# EAGLE design fg (EAGLE 7.4.0)
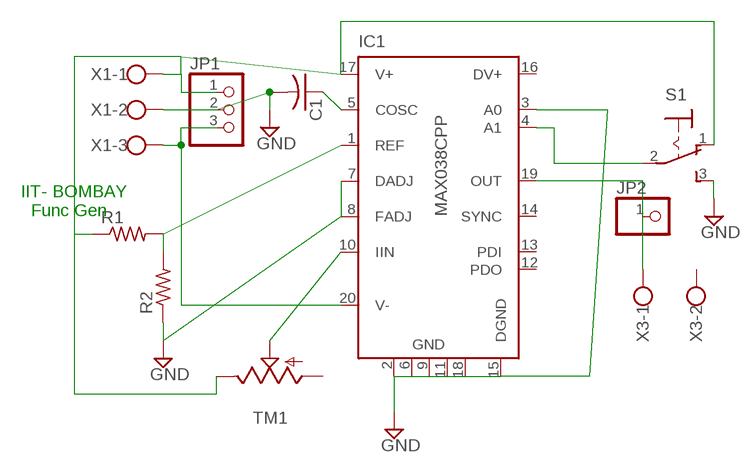
[diagram p0: schematic, sheet 1]

## Parts
C1  C-US050-045X075  [C050-045X075]
IC1  MAX038CPP  [DIL20]
JP1  PINHD-1X3CB  [1X03-CLEANBIG]
JP2  PINHD-1X1CB  [1X01-CLEANBIG]
R1  R-US_0309/10  [0309/10]
R2  R-US_0309/10  [0309/10]
S1  320-916  [320-916]
TM1  TRIM  [6MM]
X1  W237-103  [W237-103]
X3  W237-102  [W237-102]

## Nets
GND: C1.2 IC1.2(GND) IC1.3(A0) IC1.6(GND) IC1.7(DADJ) IC1.8(FADJ) IC1.9(GND) IC1.11(GND) IC1.15(DGND) IC1.18(GND) JP1.2 R2.1 S1.3(S) X1.2
N$1: IC1.17(V+) JP1.1 R1.1 S1.1(O) TM1.E X1.1
N$2: IC1.20(V-) JP1.3 X1.3
N$3: C1.1 IC1.5(COSC)
N$4: IC1.1(REF) R1.2 R2.2
N$6: IC1.10(IIN) TM1.S
N$7: IC1.19(OUT) JP2.1 X3.1
N$8: IC1.4(A1) S1.2(P)
Unconnected: IC1.12(PDO) IC1.13(PDI) IC1.14(SYNC) TM1.A X3.2

## Notes on the sheet
- IIT- BOMBAY
    Func Gen

## Power pins joined to a net without a drawn wire
DV+: IC1.16(DV+)

## Library data of the parts
C1 = adafruit:C-US: CAPACITOR, American symbol
IC1 = maxim:MAX038*: HIGH FREQUENCY WAVEFORM GENERATOR; OC_FARNELL: unknown; OC_NEWARK: unknown
JP1 = adafruit:PINHD-1X3: PIN HEADER
JP2 = adafruit:PINHD-1X1: Pin header 1x1 for 0.1" spacing With round pins
R1 R2 = adafruit:R-US_: RESISTOR, American symbol
S1 = switch:320-916: TOGGLE SWITCH distributor RS Components
TM1 = adafruit:TRIM
X1 = con-wago-500:W237-103: WAGO SCREW CLAMP; MPN: 237-103; OC_FARNELL: unknown; OC_NEWARK: 18M7116
X3 = con-wago-500:W237-102: WAGO SCREW CLAMP; MPN: 237-102; OC_FARNELL: unknown; OC_NEWARK: 70K9898

## Board
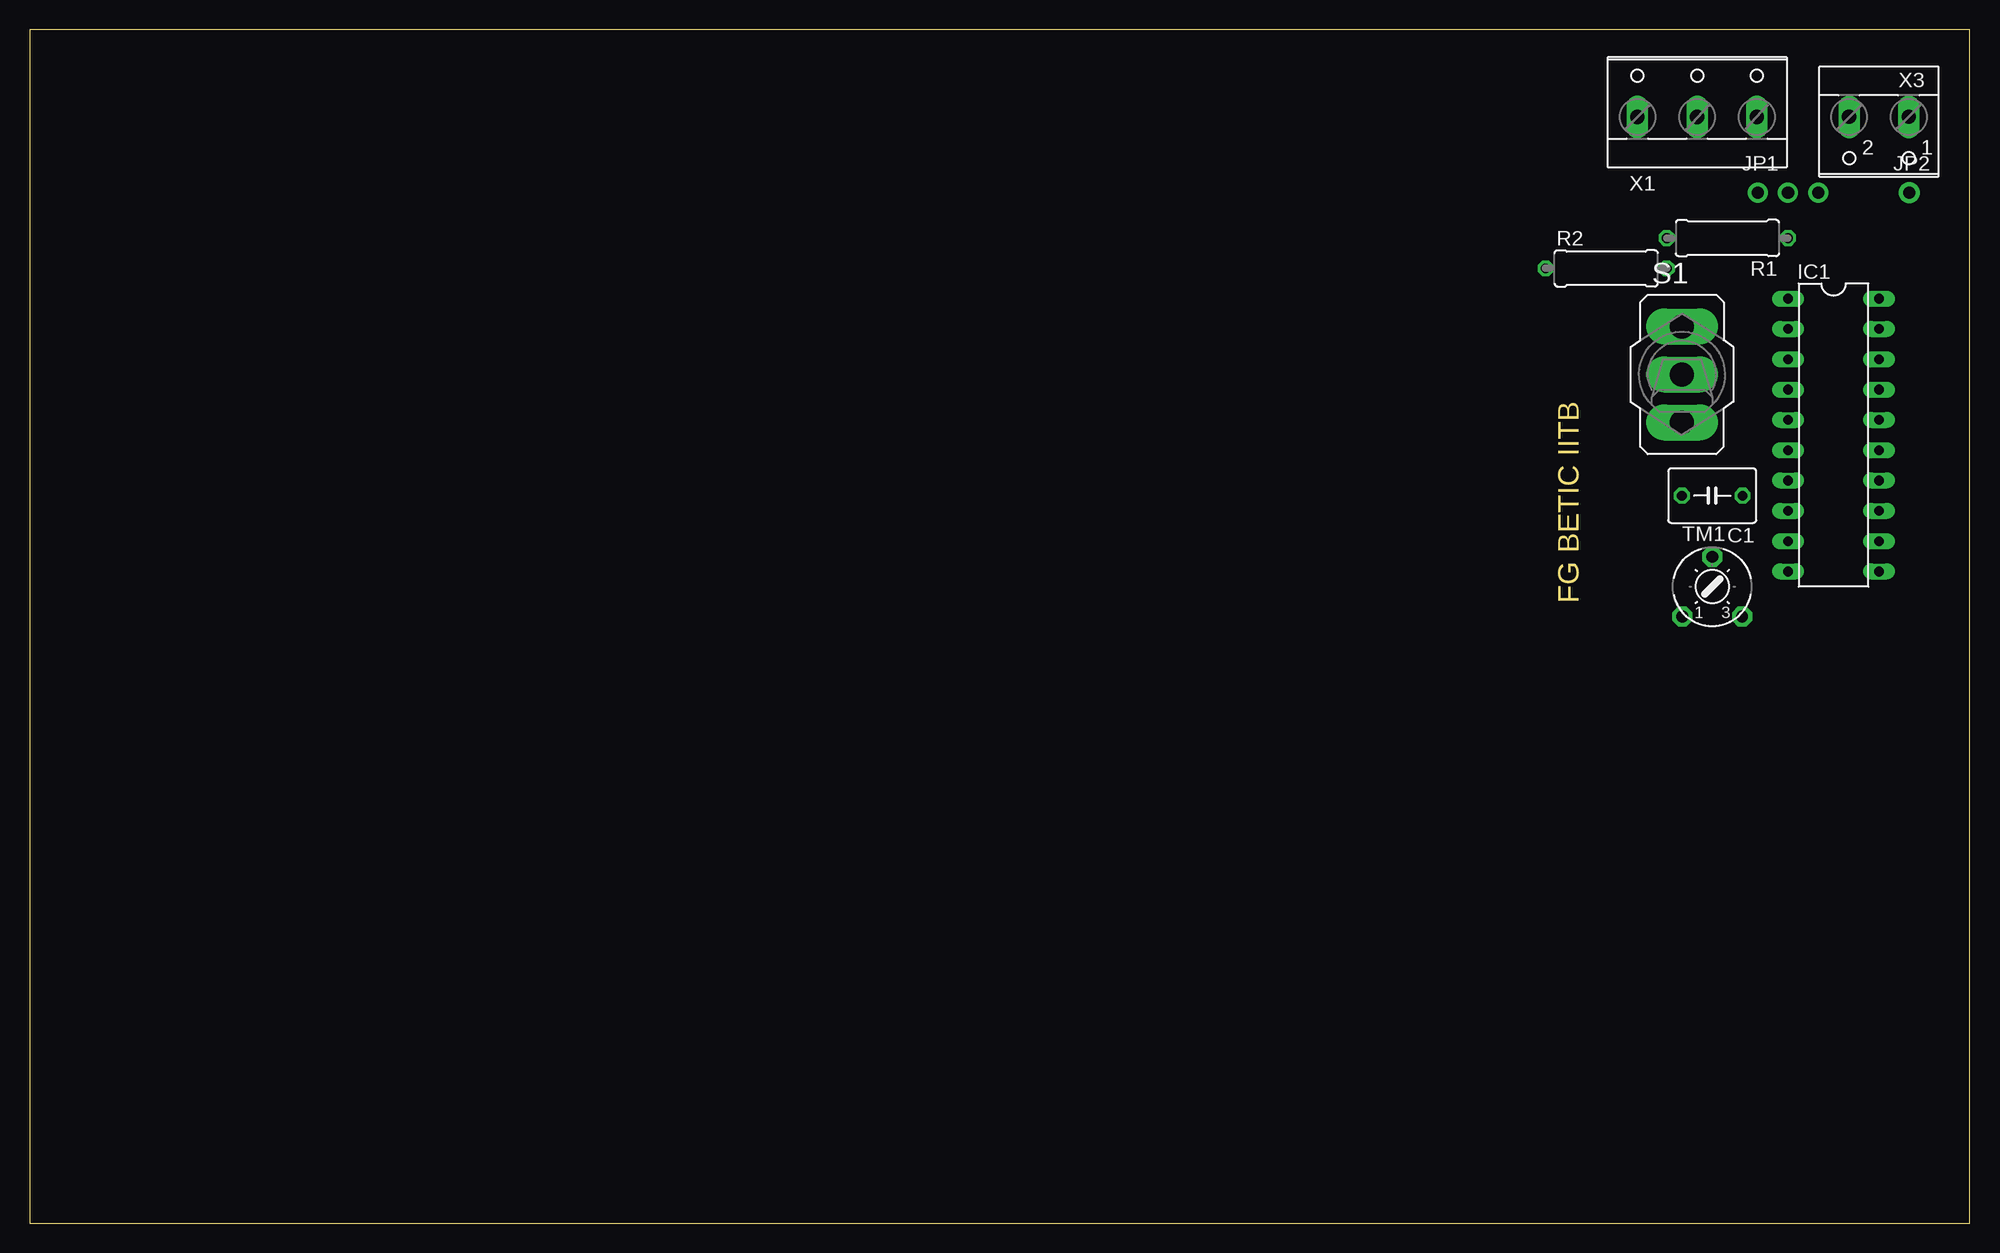
[diagram p1: board, top side]
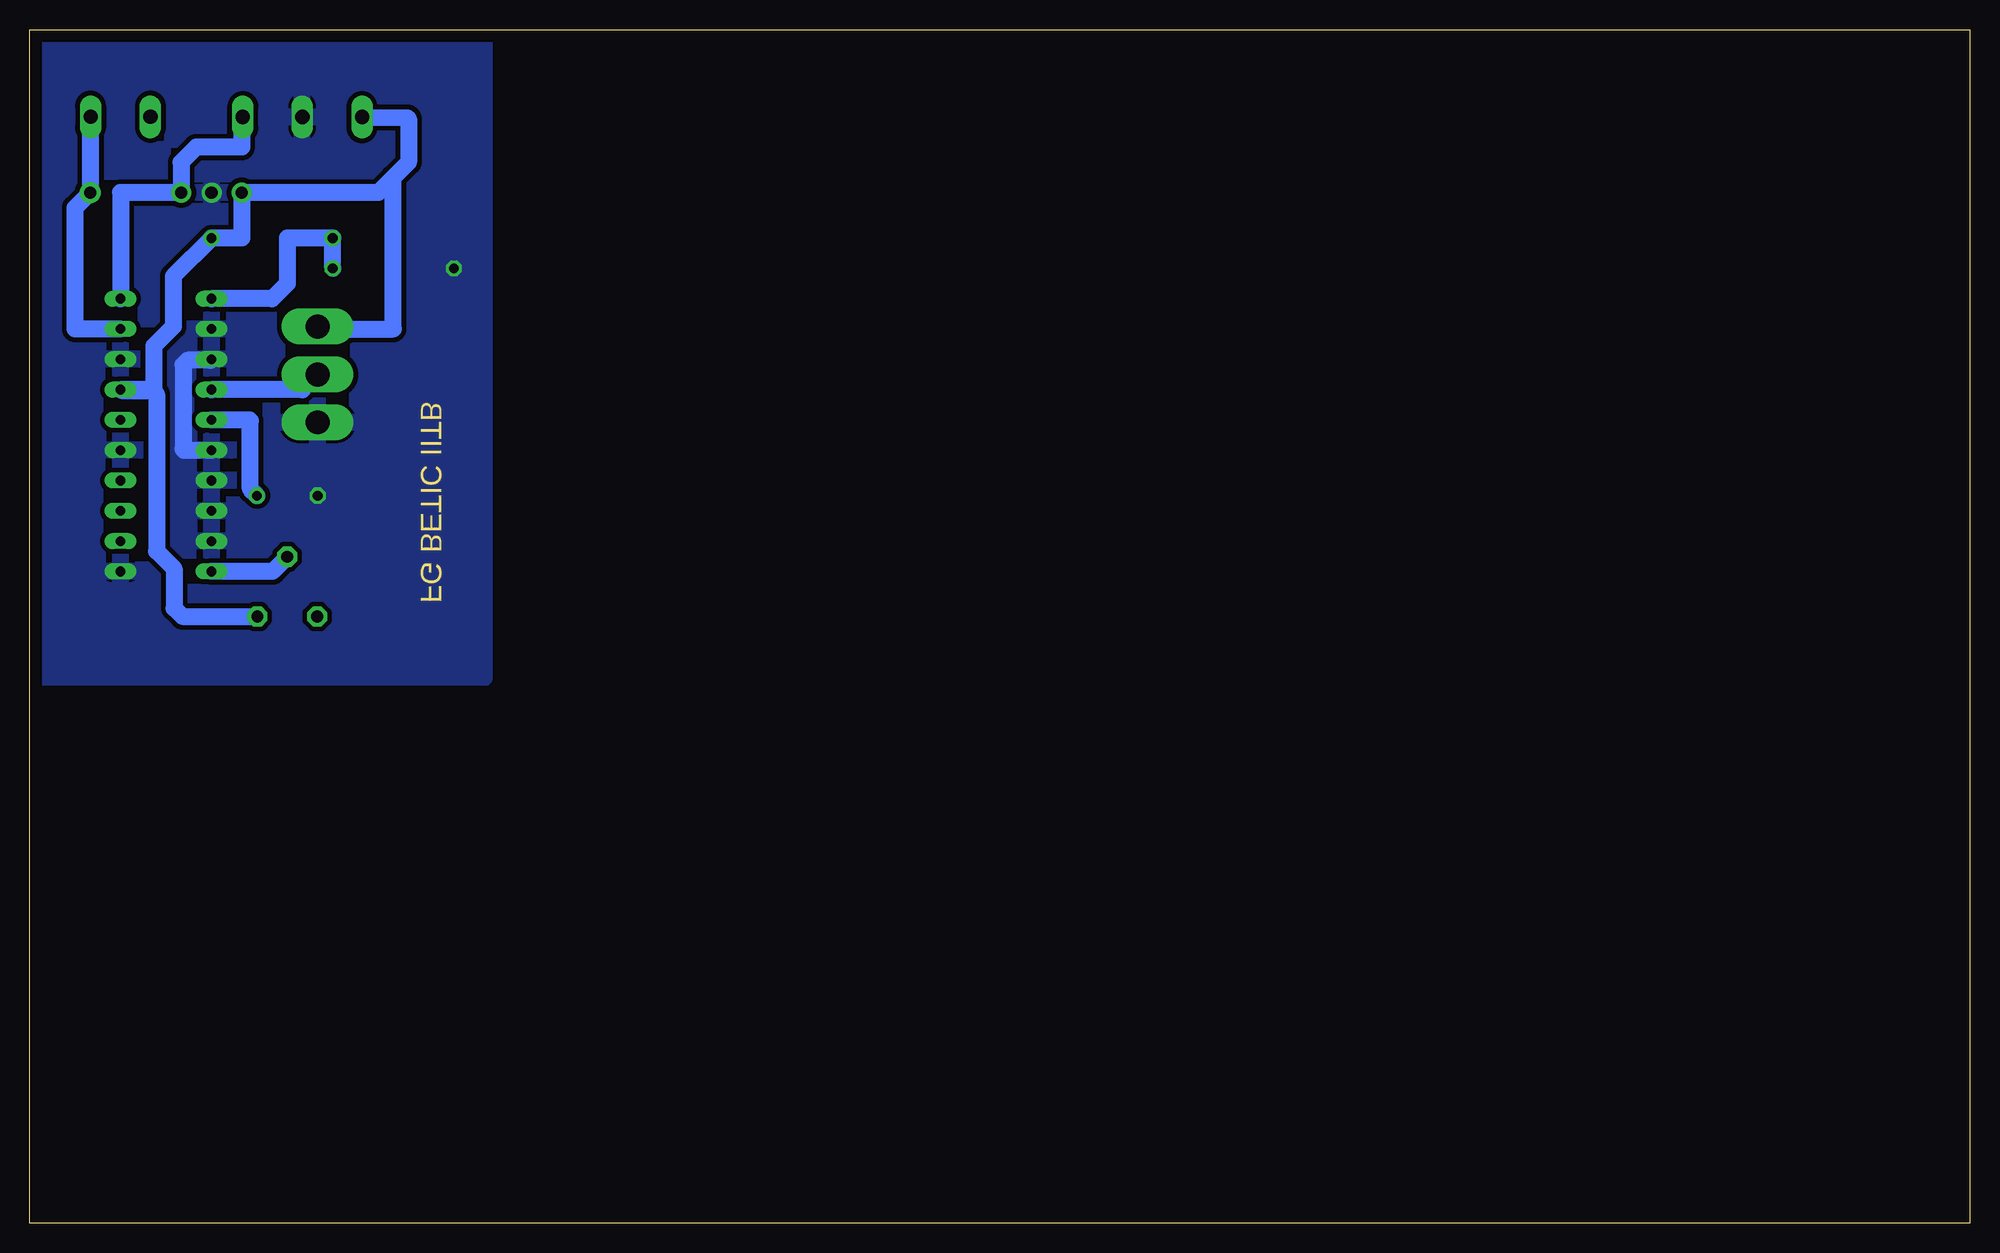
[diagram p2: board, bottom side, seen from below]

Size 162.54 x 100 mm. Coordinates in mm from the lower left corner, seen from the top.
Outline: 0,0 162.54,0 162.54,100 0,100 0,0
Copper layers (1*16): Top 0.035mm / dielectric 1.5mm / Bottom 0.035mm
Design rules "default *": minimum track width 10mil, minimum drill 24mil, track to track 16mil, track to pad 16mil, pad to pad 16mil, via to via 16mil, smd to smd 16mil, copper to edge 40mil, drill to drill 8mil, minimum pad ring 10mil, minimum via ring 8mil, stop-mask expansion 4mil, vias tented up to drill 0mil, thermal gap 10mil

### Footprints (pad centres in the part's own frame; a part is rotated, then mirrored left to right if it is on the bottom)
C050-045X075 = drill 0.813 octagon: 1 -2.54,0; 2 2.54,0
DIL20 = drill 0.813 long: 1 -11.43,-3.81; 2 -8.89,-3.81; 3 -6.35,-3.81; 4 -3.81,-3.81; 5 -1.27,-3.81; 6 1.27,-3.81; 7 3.81,-3.81; 8 6.35,-3.81; 9 8.89,-3.81; 10 11.43,-3.81; 11 11.43,3.81; 12 8.89,3.81; 13 6.35,3.81; 14 3.81,3.81; 15 1.27,3.81; 16 -1.27,3.81; 17 -3.81,3.81; 18 -6.35,3.81; 19 -8.89,3.81; 20 -11.43,3.81
1X03-CLEANBIG = drill 1.016 pad 1.676: 1 -2.54,0; 2 0,0; 3 2.54,0
1X01-CLEANBIG = drill 1.016 pad 1.778: 1 0,0
0309/10 = drill 0.813 octagon: 1 -5.08,0; 2 5.08,0
320-916 = drill 2.007 long: 1 0,4.013; 2 0,0; 3 0,-4.013
6MM = drill 1 pad 1.676 octagon: A -2.5,-2.5; E 2.5,-2.5; S 0,2.5
W237-103 = drill 1.194 long: 1 -5,-1.29; 2 0,-1.29; 3 5,-1.29
W237-102 = drill 1.194 long: 1 -2.5,-1.27; 2 2.5,-1.27

### Placement (x,y rotation side)
C1  140.97,60.96 180 top
IC1  151.13,66.04 270 top
JP1  147.32,86.36 0 top
JP2  157.48,86.36 0 top
R1  142.24,82.55 180 top
R2  132.08,80.01 0 top
S1  138.43,71.12 0 top
TM1  140.97,53.34 0 top
X1  139.7,93.98 0 top
X3  154.94,91.44 180 top

### Tracks (layer width: path | path; a pad name or v marks a point on that pad's centre or on a via)
GND
  Bottom 1.422: IC1.3 147.4,72.31 149.33,72.31 149.71,71.93 149.71,64.87 149.61,64.77 IC1.6
  pour Bottom: 162.56,100.33 124.46,100.33 124.46,97.79 124.46,45.72 162.56,45.72
N$1
  Bottom 1.422: X1.1 130.89,92.63 130.81,92.55 130.81,88.9 132.08,87.63 | 132.08,87.63 133.35,86.36 JP1.1 144.78,82.55 R1.1 150.52,79.35 150.52,75.13 152.15,73.51 152.15,69.77 152.22,69.85 IC1.17 154.86,69.77 152.22,69.77 151.92,69.47 151.92,56.31 150.44,54.84 150.44,51.54 149.75,50.84 TM1.E | S1.1 138.23,74.93 132.08,74.93 132.08,87.63
N$2
  Bottom 1.422: IC1.20 154.94,86.36 JP1.3 149.86,88.9 148.59,90.17 144.78,90.17 144.78,92.61 X1.3
N$3
  Bottom 1.422: C1.1 144.07,61.52 144.07,67.23 144.15,67.31 IC1.5
N$4
  Bottom 1.422: R2.2 R1.2 140.97,82.55 140.97,78.74 142.24,77.47 IC1.1
N$6
  Bottom 1.422: TM1.S 142.2,54.61 IC1.10
N$7
  Bottom 1.422: IC1.19 158.75,74.93 158.75,85.09 JP2.1 157.44,86.4 X3.1
N$8
  Bottom 1.422: S1.2 139.7,69.85 IC1.4

### Text on the board
Dimension: FG BETIC IITB